# Altium schematic sheet Output_Analog.SchDoc
size A4
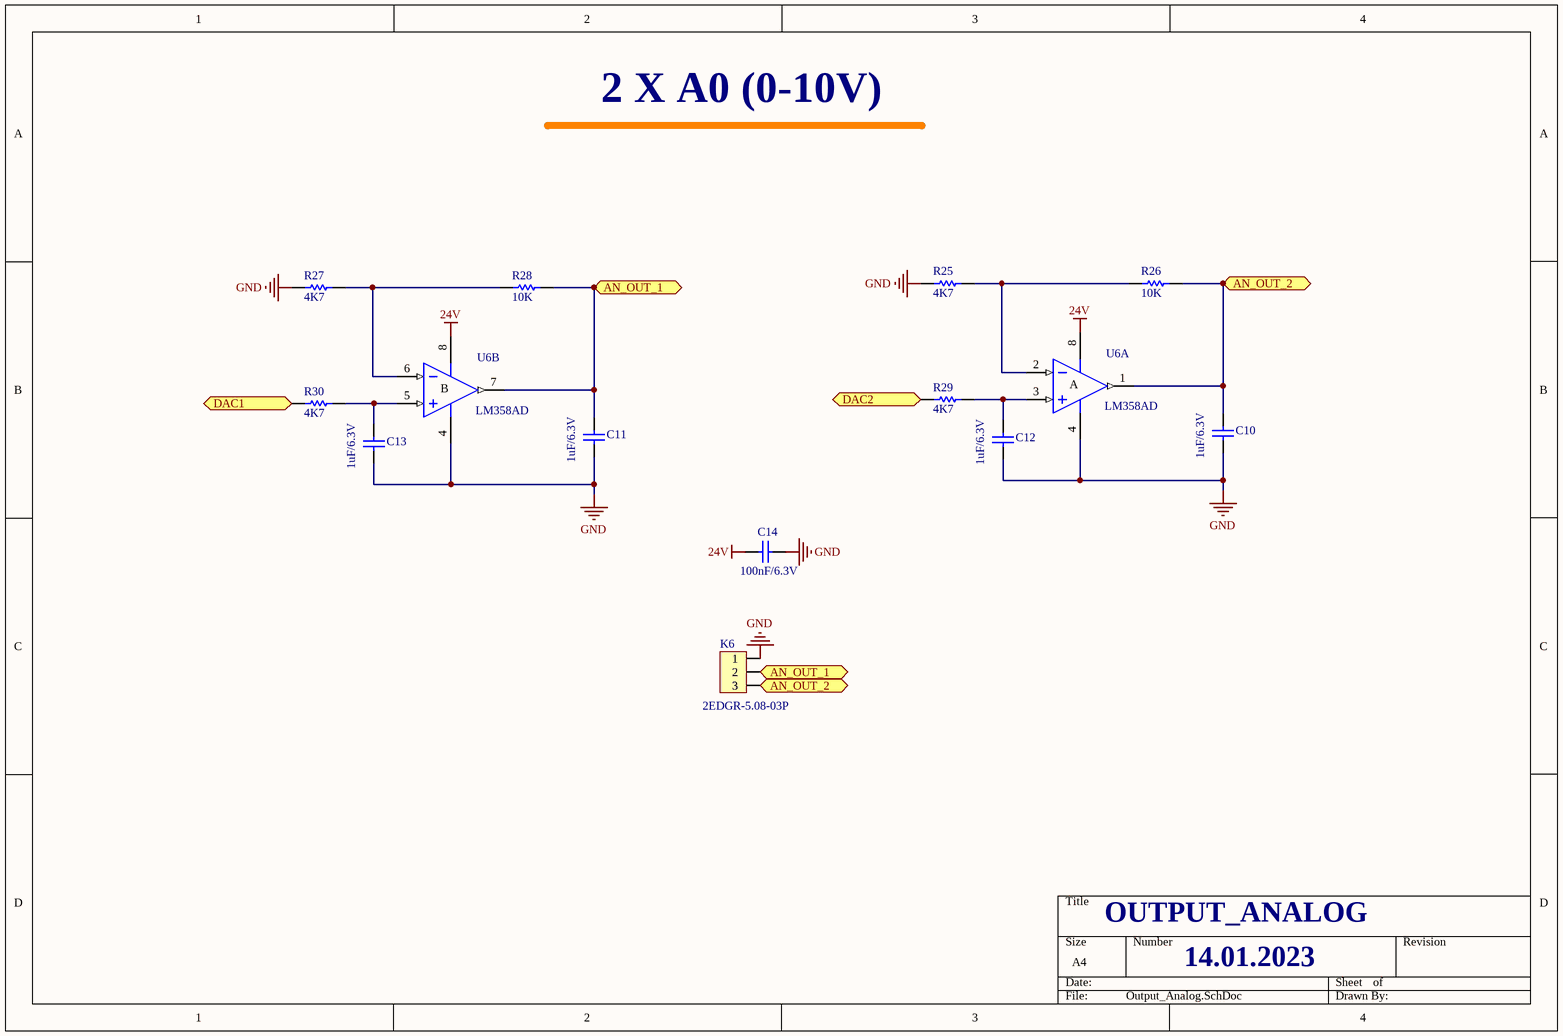
[diagram p0: Output_Analog.SchDoc]

## Parts
C10  1uF/6.3V  [CAP0603W]
C11  1uF/6.3V  [CAP0603W]
C12  1uF/6.3V  [CAP0603W]
C13  1uF/6.3V  [CAP0603W]
C14  100nF/6.3V  [CAP0603W]
K6  2EDGR-5.08-03P  [CON_DG129_03P]
R25  4K7  [RES1608[0603]]
R26  10K  [RES1608[0603]]
R27  4K7  [RES1608[0603]]
R28  10K  [RES1608[0603]]
R29  4K7  [RES1608[0603]]
R30  4K7  [RES1608[0603]]
U6  LM358AD  [SO8]  (parts A,B of 2)

## Ports
AN_OUT_1, AN_OUT_2, DAC1, DAC2

## Nets
24V: C14.1 U6.8(V+)
GND: C10.1 C11.1 C12.1 C13.1 C14.2 K6.1 R25.1 R27.1 U6.4(V-)
AN_OUT_1: C11.2 K6.2 R28.2 U6.7(OUT) ; port AN_OUT_1
AN_OUT_2: C10.2 K6.3 R26.2 U6.1(OUT) ; port AN_OUT_2
DAC1: R30.1 ; port DAC1
DAC2: R29.1 ; port DAC2
NetC12_2: C12.2 R29.2 U6.3(IN+)
NetC13_2: C13.2 R30.2 U6.5(IN+)
NetR25_2: R25.2 R26.1 U6.2(IN-)
NetR27_2: R27.2 R28.1 U6.6(IN-)

## Notes on the sheet
- 2 X A0 (0-10V)
- OUTPUT_ANALOG
- 14.01.2023
- (in symbol LM358AD, part A) A
- (in symbol LM358AD, part B) B

## Library data of the parts
C10-C14 = CAP1: CAPACITOR 0603 Case; Value: 100nF; Published: 8-Jun-2000; LatestRevisionDate: 17-Jul-2002; LatestRevisionNote: Re-released for DXP Platform.; PackageReference: C1206; Publisher: Altium Limited
K6 = KLEMENS_3P: CONNECTOR 5.08mm 3PIN 90DEG
R25-R30 = RES: RESISTOR 0603 Case %1; Value: 430R; Published: 8-Jun-2000; LatestRevisionDate: 17-Jul-2002; LatestRevisionNote: Re-released for DXP Platform.; PackageReference: AXIAL-0.5; Publisher: Altium Limited
U6 = LM358AD: OPAMP Low-Power Dual Operational Amplifier; Published: 24-Aug-2001; LatestRevisionDate: 13-Apr-2006; LatestRevisionNote: IPC-7351 Footprint Added.; DatasheetVersion: Jun-1998; PackageVersion: Dec-2002; PackageReference: SO8; Publisher: Altium Limited; PackageDescription: 8-Pin Small Outline Integrated Circuit 1.27 mm Pitch; Code_JEDEC: MS-012-AA; Code_IPC: SOIC127P600-8; ComponentLink1Description: Manufacturer Link; ComponentLink1URL: http://www.st.com/; ComponentLink2Description: Datasheet; ComponentLink2URL: http://www.st.com/stonline/products/literature/ds/2163/lm358.pdf